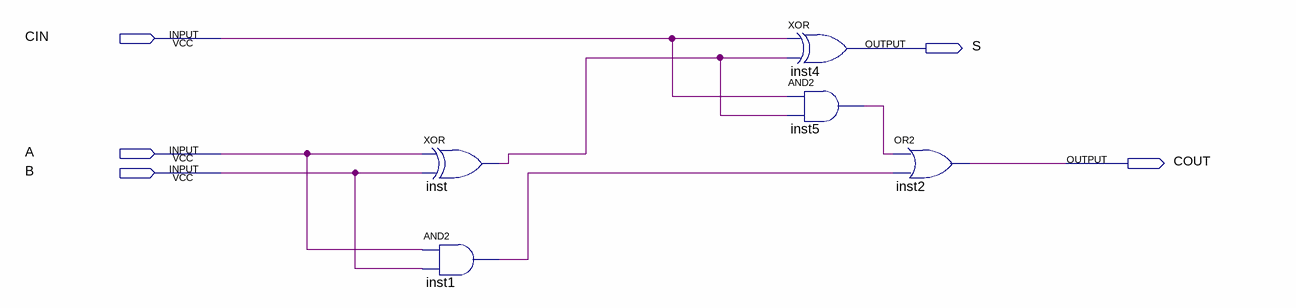
[diagram p0: schematic sheet]
// Quartus schematic SomadorCompleto.bdf as structural Verilog: 5 symbols, 5 pins
module SomadorCompleto (
  input  CIN,
  input  A,
  input  B,
  output S,
  output COUT
);

  wire inst1_out, inst5_out, inst_out;

  xor inst (inst_out, A, B);
  and inst1 (inst1_out, A, B);
  xor inst4 (S, CIN, inst_out);
  and inst5 (inst5_out, CIN, inst_out);
  or inst2 (COUT, inst5_out, inst1_out);
endmodule
